# Altium project FT232RL Model with USB-C.PrjPcb
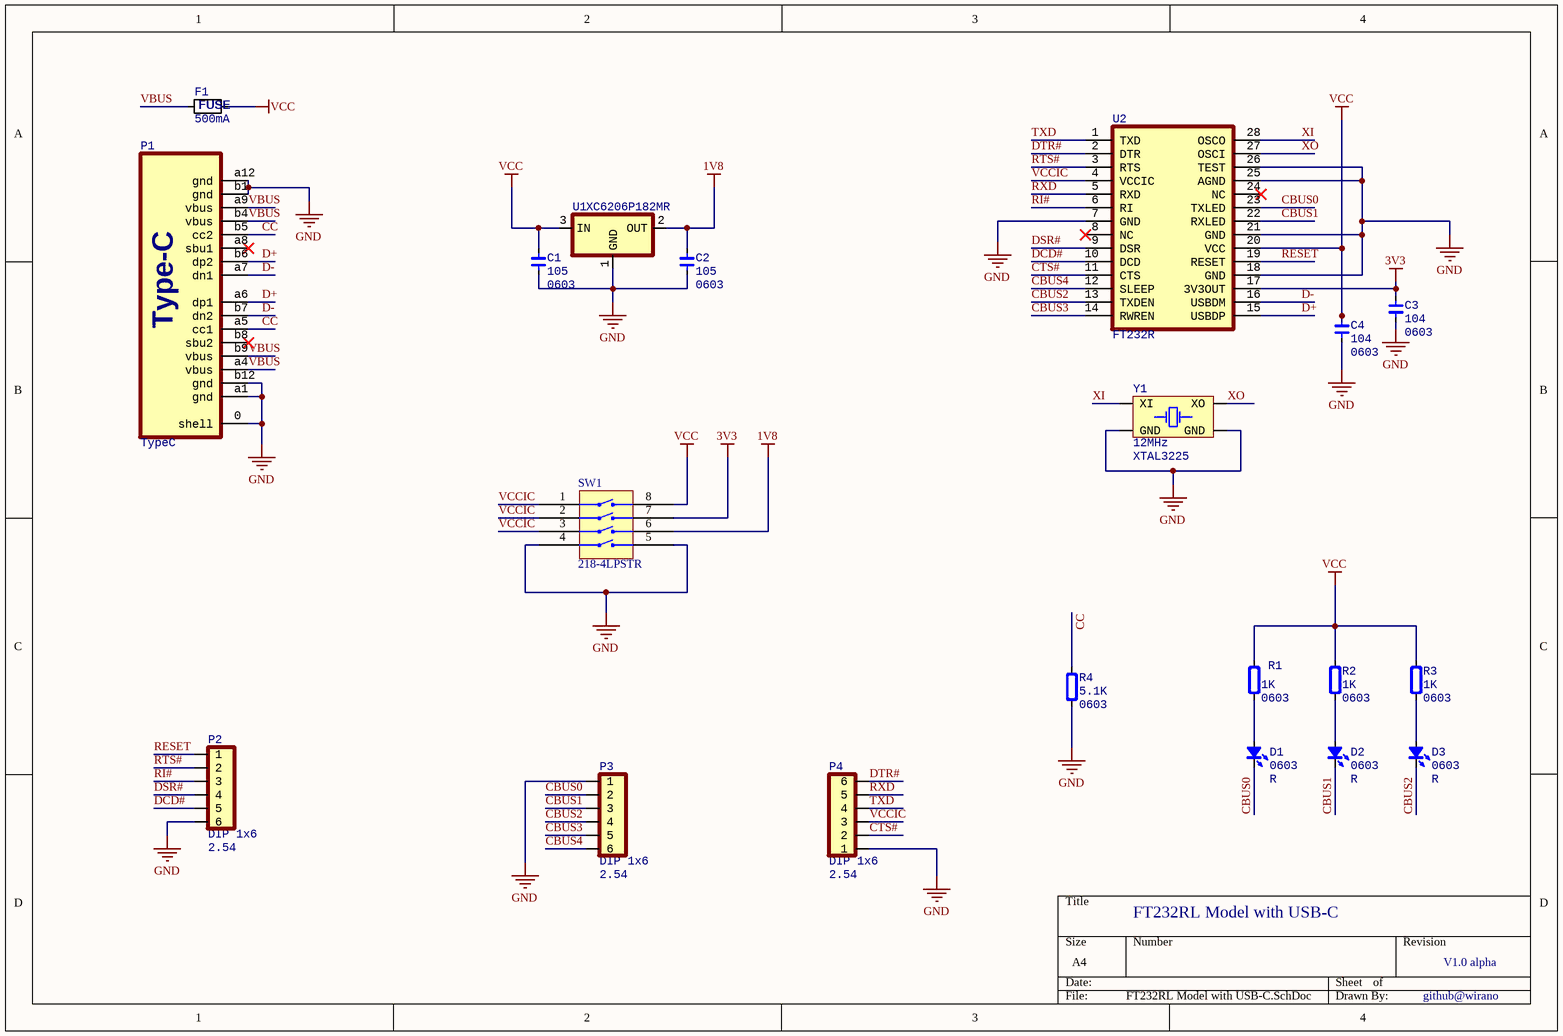
[diagram p0: FT232RL Model with USB-C.SchDoc]
1 sheet, 20 parts. Net scope: global (net labels, ports and power ports of the same name join across sheets).
Board file: FT232RL Model with USB-C.PcbDoc

## Sheet FT232RL Model with USB-C.SchDoc
size A4

### Parts
C1  value 105  Type: 0603  [CAP 0603/1608]  (hidden comment: C0603)
C2  value 105  Type: 0603  [CAP 0603/1608]  (hidden comment: C0603)
C3  value 104  Type: 0603  [CAP 0603/1608]  (hidden comment: C0603)
C4  value 104  Type: 0603  [CAP 0603/1608]  (hidden comment: C0603)
D1  Type: 0603  [LED_0603_RED]  (hidden comment: R)
D2  Type: 0603  [LED_0603_RED]  (hidden comment: R)
D3  Type: 0603  [LED_0603_RED]  (hidden comment: R)
F1  500mA  [PPTC_0603]
P1  TypeC  [USB_TypeC]
P2  value 2.54  [HDR1X6_2.54_180]  (hidden comment: DIP 1x6)
P3  value 2.54  [HDR1X6_2.54_180]  (hidden comment: DIP 1x6)
P4  value 2.54  [HDR1X6_2.54_90]  (hidden comment: DIP 1x6)
R1  value 1K  Type: 0603  [RES 0603/1608]  (hidden comment: R0603)
R2  value 1K  Type: 0603  [RES 0603/1608]  (hidden comment: R0603)
R3  value 1K  Type: 0603  [RES 0603/1608]  (hidden comment: R0603)
R4  value 5.1K  Type: 0603  [RES 0603/1608]  (hidden comment: R0603)
SW1  218-4LPSTR  [CTS 218-4LPJ]
U1  XC6206P182MR  [_SOT23-3]
U2  FT232R  [_SSOP_E210_P0.65_28]
Y1  value 12MHz  [XT_3225_4]  (hidden comment: XTAL3225)

### Nets
1V8: C2.2 SW1.6 U1.2(OUT)
3V3: C3.1 SW1.7 U2.17(3V3OUT)
GND: C1.1 C2.1 C3.2 C4.1 P1.0(shell) P1.a1(gnd) P1.a12(gnd) P1.b1(gnd) P1.b12(gnd) P2.6 P3.1 P4.1 R4.1 SW1.4(GND) SW1.5 U1.1(GND) U2.7(GND) U2.18(GND) U2.21(GND) U2.25(AGND) U2.26(TEST) Y1.2(GND) Y1.4(GND)
VCC: C1.2 C4.2 F1.2 R1.2 R2.2 R3.2 SW1.8 U1.3(IN) U2.20(VCC)
CBUS0: D1.2(K) P3.2 U2.23(TXLED)
CBUS1: D2.2(K) P3.3 U2.22(RXLED)
CBUS2: D3.2(K) P3.4 U2.13(TXDEN)
CBUS3: P3.5 U2.14(RWREN)
CBUS4: P3.6 U2.12(SLEEP)
CC: P1.a5(cc1) P1.b5(cc2) R4.2
CTS#: P4.2 U2.11(CTS)
D+: P1.a6(dp1) P1.b6(dp2) U2.15(USBDP)
D-: P1.a7(dn1) P1.b7(dn2) U2.16(USBDM)
DCD#: P2.5 U2.10(DCD)
DSR#: P2.4 U2.9(DSR)
DTR#: P4.6 U2.2(DTR)
RESET: P2.1 U2.19(RESET)
RI#: P2.3 U2.6(RI)
RTS#: P2.2 U2.3(RTS)
RXD: P4.5 U2.5(RXD)
TXD: P4.4 U2.1(TXD)
VBUS: F1.1 P1.a4(vbus) P1.a9(vbus) P1.b4(vbus) P1.b9(vbus)
VCCIC: P4.3 SW1.1(GND) SW1.2(GND) SW1.3(GND) U2.4(VCCIC)
XI: U2.28(OSCO) Y1.1(XI)
XO: U2.27(OSCI) Y1.3(XO)
NetD1_1: D1.1(A) R1.1
NetD2_1: D2.1(A) R2.1
NetD3_1: D3.1(A) R3.1

Not connected (* = marked no-connect by the designer): P1 a8(sbu1)* b8(sbu2)*; U2 8(NC)* 24(NC)*

### Notes on the sheet
- FT232RL Model with USB-C
- V1.0 alpha
- github@wirano
- (in symbol Fuse) FUSE
- (in symbol USB_TypeC) Type-C

### Library data of the parts
C1-C4 = Cap_0603: Capacitor; Specification: X7R 50V; Manufacturer: *
D1-D3 = LED_0603: LED; Value: R
F1 = Fuse: resettable fuse
P1 = USB_TypeC: USB type-c cable
P2-P4 = HDR1x6_2.54: Header; Type: DIP 1x6
R1-R4 = Res_0603: SMT Resistor; Specification: ±5%; Manufacturer: *
SW1 = 218-4LPSTR: SWITCH SLIDE DIP SPST 25MA 24V; Manufacturer: CTS Electrocomponents; Actuator Level: Flush, Recessed; Actuator Type: Slide (Standard); Number of Positions: 4; Pitch: 0.050" (1.27mm), Half; Voltage Rating: 24VDC; Washable: Yes; Part Number: 218-4LPSTR; Circuit: SPST; ComponentLink1Description: Datasheet; ComponentLink1URL: https://www.ctscorp.com/wp-content/uploads/218.pdf; ComponentLink2Description: DigiKey Link; ComponentLink2URL: http://digikey.com/product-detail/en/cts-electrocomponents/218-4LPSTR/CT3110CT-ND/5875763; Contact Finish: Gold; Contact Material: Beryllium Copper; Current Rating (Amps): 25mA; Features: Epoxy Sealed Terminals, Tape Seal; Height Above Board: 0.104" (2.65mm); LastUpdated: 20/1/4 周六 18:53:14; Lifecycle Status: Active; Minimum Order: 1; Mounting Type: Surface Mount; Operating Temperature: -55°C ~ 85°C; Packaging: ReReel; PartId: 9; Part Status: Active; Price: 0.00; Series: 218; Supplier 1: DigiKey; Supplier Part Number 1: CT3110CT-ND; Termination Style: Gull Wing
U1 = XC6206P332MR: Regulator LDO
U2 = FT232R: USB to UART Converter
Y1 = XTAL_3225_4P: Crystal Oscillator; Type: XTAL3225